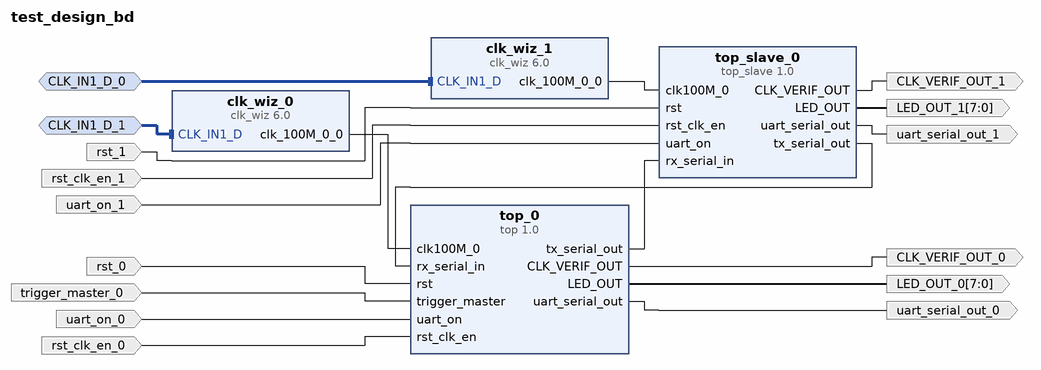
[diagram p0: block diagram of the top level]
# Vivado block design test_design_bd, xc7vx485tffg1761-2, Vivado 2018.3
create_bd_design test_design_bd

create_bd_intf_port -mode Slave -vlnv xilinx.com:interface:diff_clock_rtl:1.0 CLK_IN1_D_0
create_bd_intf_port -mode Slave -vlnv xilinx.com:interface:diff_clock_rtl:1.0 CLK_IN1_D_1
create_bd_port -dir I rst_clk_en_0
create_bd_port -dir O CLK_VERIF_OUT_1
create_bd_port -dir O -from 7 -to 0 LED_OUT_1
create_bd_port -dir I -type rst rst_1
create_bd_port -dir I rst_clk_en_1
create_bd_port -dir I uart_on_1
create_bd_port -dir O uart_serial_out_1
create_bd_port -dir O CLK_VERIF_OUT_0
create_bd_port -dir O -from 7 -to 0 LED_OUT_0
create_bd_port -dir I -type rst rst_0
create_bd_port -dir I trigger_master_0
create_bd_port -dir I uart_on_0
create_bd_port -dir O uart_serial_out_0

create_bd_cell -type ip -vlnv xilinx.com:ip:clk_wiz:6.0 clk_wiz_0
set_property -dict [list \
  CONFIG.CLKIN1_JITTER_PS 50.0 \
  CONFIG.CLKOUT1_JITTER 155.788 \
  CONFIG.CLKOUT1_PHASE_ERROR 94.329 \
  CONFIG.CLKOUT1_REQUESTED_OUT_FREQ 20 \
  CONFIG.CLK_IN1_BOARD_INTERFACE sys_diff_clock \
  CONFIG.CLK_OUT1_PORT clk_100M_0_0 \
  CONFIG.MMCM_CLKFBOUT_MULT_F 4.250 \
  CONFIG.MMCM_CLKIN1_PERIOD 5.000 \
  CONFIG.MMCM_CLKIN2_PERIOD 10.0 \
  CONFIG.MMCM_CLKOUT0_DIVIDE_F 42.500 \
  CONFIG.MMCM_DIVCLK_DIVIDE 1 \
  CONFIG.PRIM_SOURCE Differential_clock_capable_pin \
  CONFIG.USE_LOCKED false \
  CONFIG.USE_RESET false \
] [get_bd_cells clk_wiz_0]
create_bd_cell -type ip -vlnv xilinx.com:ip:clk_wiz:6.0 clk_wiz_1
set_property -dict [list \
  CONFIG.CLKIN1_JITTER_PS 50.0 \
  CONFIG.CLKOUT1_JITTER 155.788 \
  CONFIG.CLKOUT1_PHASE_ERROR 94.329 \
  CONFIG.CLKOUT1_REQUESTED_OUT_FREQ 20 \
  CONFIG.CLK_IN1_BOARD_INTERFACE sys_diff_clock \
  CONFIG.CLK_OUT1_PORT clk_100M_0_0 \
  CONFIG.MMCM_CLKFBOUT_MULT_F 4.250 \
  CONFIG.MMCM_CLKIN1_PERIOD 5.000 \
  CONFIG.MMCM_CLKIN2_PERIOD 10.0 \
  CONFIG.MMCM_CLKOUT0_DIVIDE_F 42.500 \
  CONFIG.MMCM_DIVCLK_DIVIDE 1 \
  CONFIG.PRIM_SOURCE Differential_clock_capable_pin \
  CONFIG.USE_LOCKED false \
  CONFIG.USE_RESET false \
] [get_bd_cells clk_wiz_1]
create_bd_cell -type ip -vlnv user.org:user:top_slave:1.0 top_slave_0
create_bd_cell -type ip -vlnv user.org:user:top:1.0 top_0

# ---- connections ----

connect_bd_intf_net -intf_net CLK_IN1_D_1_1 [get_bd_intf_ports CLK_IN1_D_1] [get_bd_intf_pins clk_wiz_0/CLK_IN1_D]
connect_bd_intf_net -intf_net CLK_IN1_D_0_1 [get_bd_intf_ports CLK_IN1_D_0] [get_bd_intf_pins clk_wiz_1/CLK_IN1_D]
connect_bd_net [get_bd_pins clk_wiz_1/clk_100M_0_0] [get_bd_pins top_slave_0/clk100M_0]
connect_bd_net [get_bd_pins top_slave_0/CLK_VERIF_OUT] [get_bd_ports CLK_VERIF_OUT_1]
connect_bd_net [get_bd_pins top_slave_0/LED_OUT] [get_bd_ports LED_OUT_1]
connect_bd_net -net rst_1_1 [get_bd_ports rst_1] [get_bd_pins top_slave_0/rst]
connect_bd_net -net rst_clk_en_1_1 [get_bd_ports rst_clk_en_1] [get_bd_pins top_slave_0/rst_clk_en]
connect_bd_net -net uart_on_1_1 [get_bd_ports uart_on_1] [get_bd_pins top_slave_0/uart_on]
connect_bd_net [get_bd_pins top_slave_0/uart_serial_out] [get_bd_ports uart_serial_out_1]
connect_bd_net [get_bd_pins clk_wiz_0/clk_100M_0_0] [get_bd_pins top_0/clk100M_0]
connect_bd_net [get_bd_pins top_slave_0/tx_serial_out] [get_bd_pins top_0/rx_serial_in]
connect_bd_net [get_bd_pins top_0/tx_serial_out] [get_bd_pins top_slave_0/rx_serial_in]
connect_bd_net [get_bd_pins top_0/CLK_VERIF_OUT] [get_bd_ports CLK_VERIF_OUT_0]
connect_bd_net [get_bd_pins top_0/LED_OUT] [get_bd_ports LED_OUT_0]
connect_bd_net -net rst_0_1 [get_bd_ports rst_0] [get_bd_pins top_0/rst]
connect_bd_net -net trigger_master_0_1 [get_bd_ports trigger_master_0] [get_bd_pins top_0/trigger_master]
connect_bd_net -net uart_on_0_1 [get_bd_ports uart_on_0] [get_bd_pins top_0/uart_on]
connect_bd_net [get_bd_pins top_0/uart_serial_out] [get_bd_ports uart_serial_out_0]
connect_bd_net -net rst_clk_en_0_1 [get_bd_ports rst_clk_en_0] [get_bd_pins top_0/rst_clk_en]

validate_bd_design
save_bd_design
